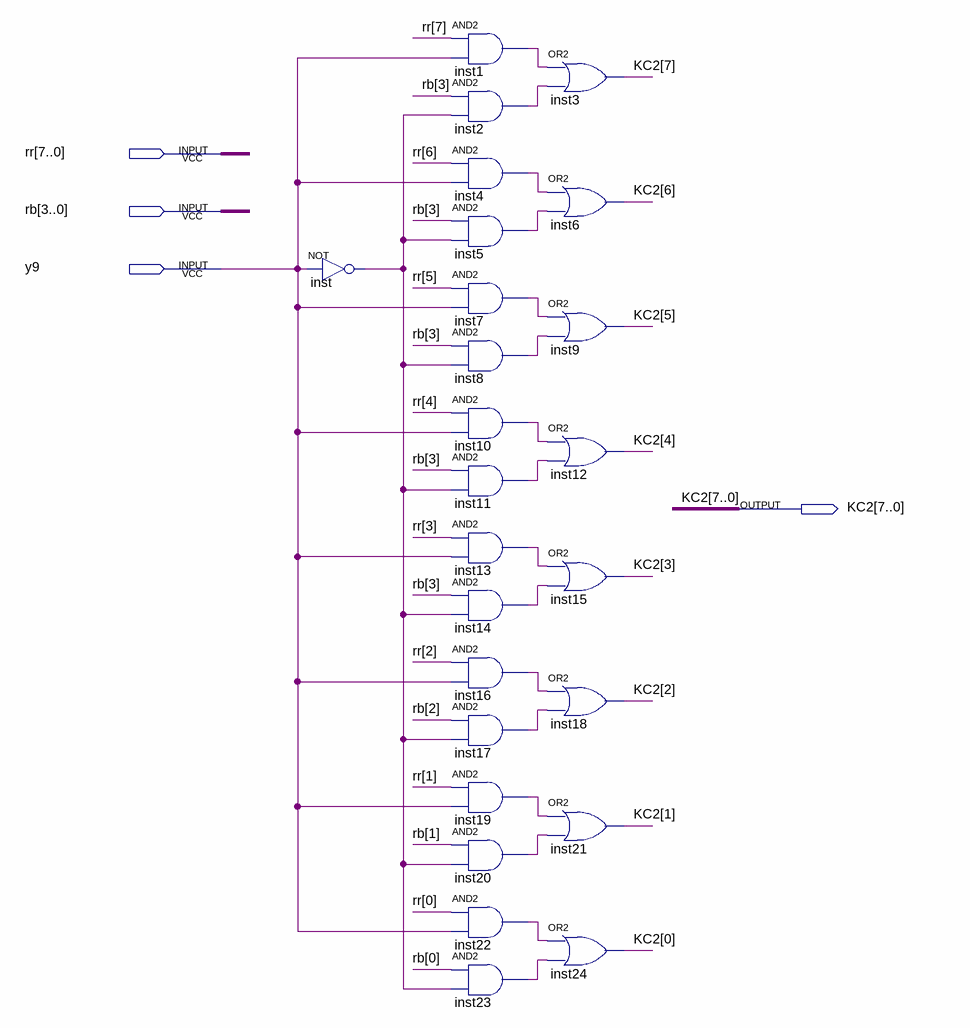
[diagram p0: schematic sheet]
// Quartus schematic KC2.bdf as structural Verilog: 25 symbols, 4 pins
module KC2 (
  input  [7:0] rr,
  input  [3:0] rb,
  input  y9,
  output [7:0] KC2
);

  wire inst1_out, inst2_out, inst4_out, inst5_out, inst7_out, inst8_out, inst10_out, inst11_out, inst13_out,
       inst14_out, inst16_out, inst17_out, inst19_out, inst20_out, inst22_out, inst23_out, inst_out;

  not inst (inst_out, y9);
  and inst1 (inst1_out, rr[7], y9);
  and inst2 (inst2_out, rb[3], inst_out);
  and inst4 (inst4_out, rr[6], y9);
  and inst5 (inst5_out, rb[3], inst_out);
  and inst7 (inst7_out, rr[5], y9);
  and inst8 (inst8_out, rb[3], inst_out);
  and inst10 (inst10_out, rr[4], y9);
  and inst11 (inst11_out, rb[3], inst_out);
  and inst13 (inst13_out, rr[3], y9);
  and inst14 (inst14_out, rb[3], inst_out);
  and inst16 (inst16_out, rr[2], y9);
  and inst17 (inst17_out, rb[2], inst_out);
  and inst19 (inst19_out, rr[1], y9);
  and inst20 (inst20_out, rb[1], inst_out);
  and inst22 (inst22_out, rr[0], y9);
  and inst23 (inst23_out, rb[0], inst_out);
  or inst3 (KC2[7], inst1_out, inst2_out);
  or inst6 (KC2[6], inst4_out, inst5_out);
  or inst9 (KC2[5], inst7_out, inst8_out);
  or inst12 (KC2[4], inst10_out, inst11_out);
  or inst15 (KC2[3], inst13_out, inst14_out);
  or inst18 (KC2[2], inst16_out, inst17_out);
  or inst21 (KC2[1], inst19_out, inst20_out);
  or inst24 (KC2[0], inst22_out, inst23_out);
endmodule
